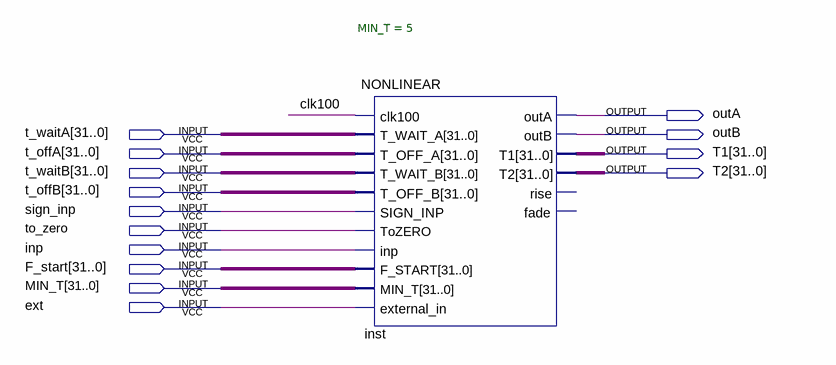
[diagram p0: schematic sheet]
// Quartus schematic Nonlinear_test.bdf as structural Verilog: 1 symbols, 14 pins
module Nonlinear_test (
  input  [31:0] t_waitA,
  input  [31:0] t_offA,
  input  [31:0] t_waitB,
  input  [31:0] t_offB,
  input  sign_inp,
  input  to_zero,
  input  inp,
  input  [31:0] F_start,
  input  [31:0] MIN_T,
  input  ext,
  output outA,
  output outB,
  output [31:0] T1,
  output [31:0] T2
);

  wire clk100;

  NONLINEAR #(.MIN_T(5)) inst (
    .clk100(clk100), .T_WAIT_A(t_waitA), .T_OFF_A(t_offA), .T_WAIT_B(t_waitB), .T_OFF_B(t_offB),
    .SIGN_INP(sign_inp), .ToZERO(to_zero), .inp(inp), .F_START(F_start), .MIN_T(MIN_T), .external_in(ext),
    .outA(outA), .outB(outB), .T1(T1), .T2(T2));  // open: rise, fade
endmodule
